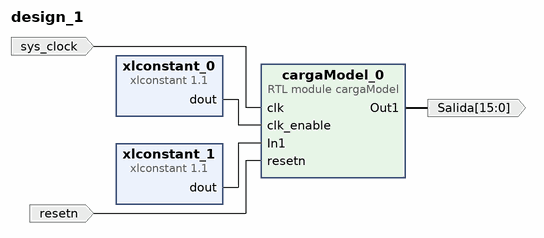
[diagram p0: block diagram of the top level]
# Vivado block design design_1, xc7a35ticsg324-1L, Vivado 2018.2
create_bd_design design_1

create_bd_port -dir I -type clk sys_clock
set_property -dict {CONFIG.FREQ_HZ 100000000 CONFIG.PHASE 0.000} [get_bd_ports sys_clock]
create_bd_port -dir I -type rst resetn
create_bd_port -dir O -from 15 -to 0 -type data Salida

create_bd_cell -type module -reference cargaModel cargaModel_0
create_bd_cell -type ip -vlnv xilinx.com:ip:xlconstant:1.1 xlconstant_0
create_bd_cell -type ip -vlnv xilinx.com:ip:xlconstant:1.1 xlconstant_1
set_property -dict {CONFIG.CONST_WIDTH 16 CONFIG.CONST_VAL 0} [get_bd_cells xlconstant_1]

# ---- connections ----

connect_bd_net [get_bd_ports sys_clock] [get_bd_pins cargaModel_0/clk]
connect_bd_net [get_bd_ports resetn] [get_bd_pins cargaModel_0/resetn]
connect_bd_net [get_bd_pins xlconstant_0/dout] [get_bd_pins cargaModel_0/clk_enable]
connect_bd_net [get_bd_pins xlconstant_1/dout] [get_bd_pins cargaModel_0/In1]
connect_bd_net [get_bd_pins cargaModel_0/Out1] [get_bd_ports Salida]

validate_bd_design
save_bd_design
